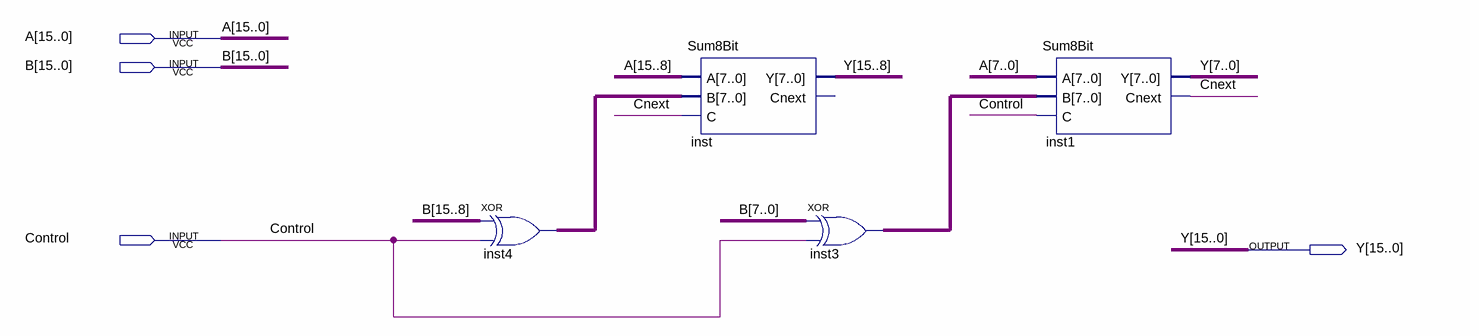
[diagram p0: schematic sheet]
// Quartus schematic SumorSub.bdf as structural Verilog: 4 symbols, 4 pins
module SumorSub (
  input  [15:0] A,
  input  [15:0] B,
  input  Control,
  output [15:0] Y
);

  wire Cnext;
  wire [7:0] inst3_out, inst4_out;

  assign inst4_out = B[15:8] ^ {8{Control}};  // XOR inst4, 8 bits wide
  Sum8Bit inst (.A(A[15:8]), .B(inst4_out), .C(Cnext), .Y(Y[15:8]));  // open: Cnext
  assign inst3_out = B[7:0] ^ {8{Control}};  // XOR inst3, 8 bits wide
  Sum8Bit inst1 (.A(A[7:0]), .B(inst3_out), .C(Control), .Y(Y[7:0]), .Cnext(Cnext));
endmodule
